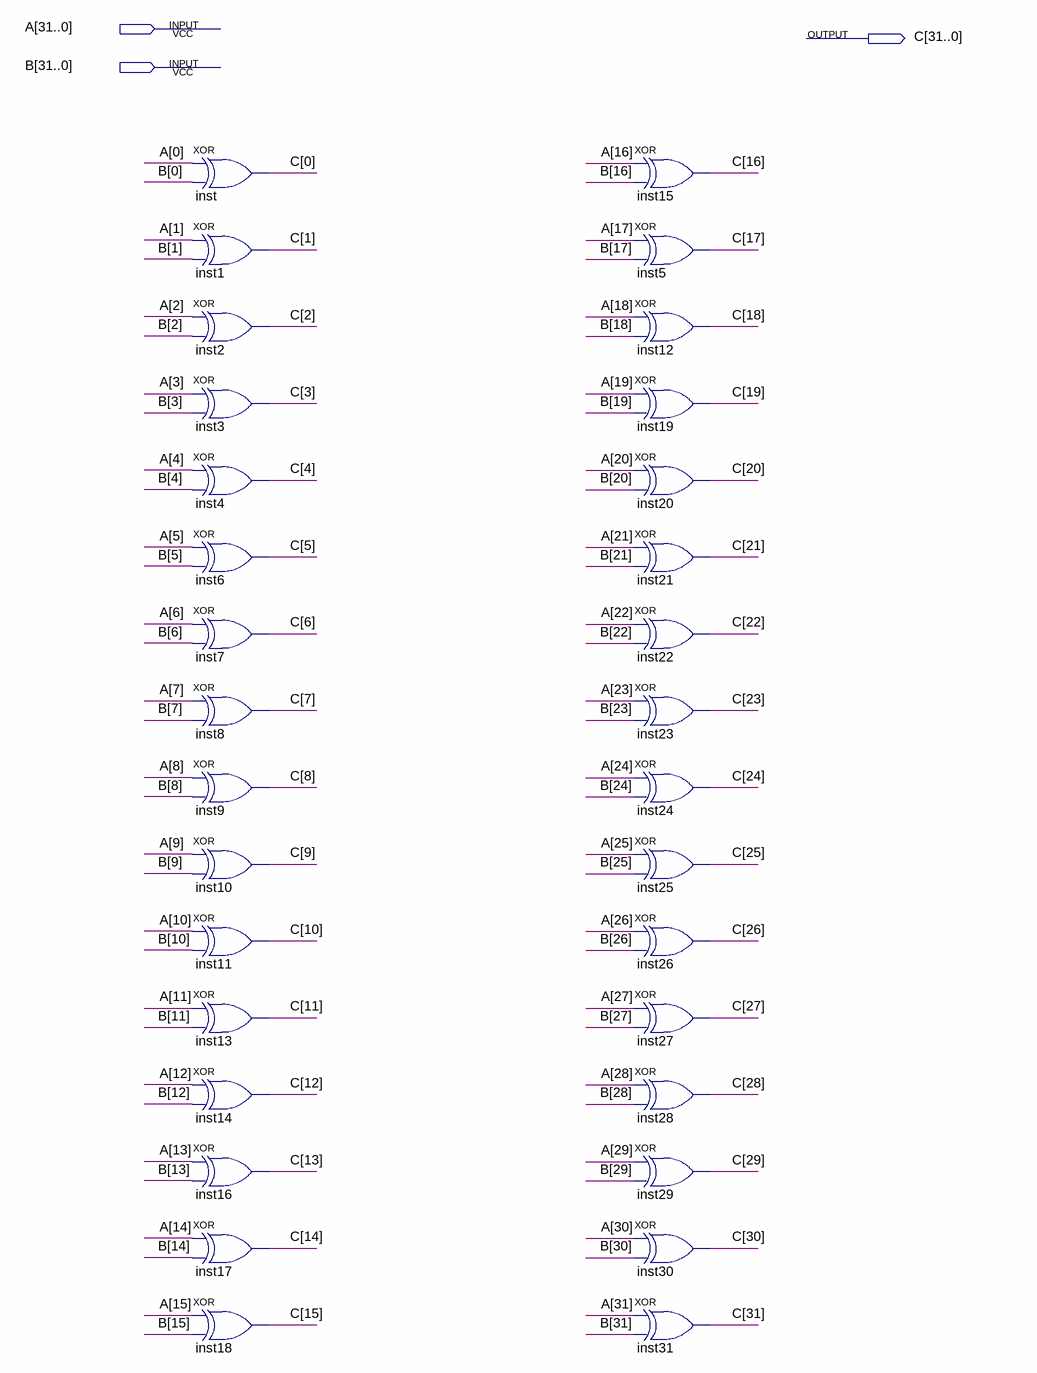
[diagram p0: schematic sheet]
// Quartus schematic XOR2_32BIT.bdf as structural Verilog: 32 symbols, 3 pins
module XOR2_32BIT (
  input  [31:0] A,
  input  [31:0] B,
  output [31:0] C
);

  xor inst (C[0], A[0], B[0]);
  xor inst1 (C[1], A[1], B[1]);
  xor inst2 (C[2], A[2], B[2]);
  xor inst3 (C[3], A[3], B[3]);
  xor inst4 (C[4], A[4], B[4]);
  xor inst6 (C[5], A[5], B[5]);
  xor inst7 (C[6], A[6], B[6]);
  xor inst8 (C[7], A[7], B[7]);
  xor inst9 (C[8], A[8], B[8]);
  xor inst10 (C[9], A[9], B[9]);
  xor inst11 (C[10], A[10], B[10]);
  xor inst13 (C[11], A[11], B[11]);
  xor inst14 (C[12], A[12], B[12]);
  xor inst16 (C[13], A[13], B[13]);
  xor inst17 (C[14], A[14], B[14]);
  xor inst18 (C[15], A[15], B[15]);
  xor inst15 (C[16], A[16], B[16]);
  xor inst5 (C[17], A[17], B[17]);
  xor inst12 (C[18], A[18], B[18]);
  xor inst19 (C[19], A[19], B[19]);
  xor inst20 (C[20], A[20], B[20]);
  xor inst21 (C[21], A[21], B[21]);
  xor inst22 (C[22], A[22], B[22]);
  xor inst23 (C[23], A[23], B[23]);
  xor inst24 (C[24], A[24], B[24]);
  xor inst25 (C[25], A[25], B[25]);
  xor inst26 (C[26], A[26], B[26]);
  xor inst27 (C[27], A[27], B[27]);
  xor inst28 (C[28], A[28], B[28]);
  xor inst29 (C[29], A[29], B[29]);
  xor inst30 (C[30], A[30], B[30]);
  xor inst31 (C[31], A[31], B[31]);
endmodule
